# Altium schematic sheet sedsna.SchDoc
size 420 x 297 mm
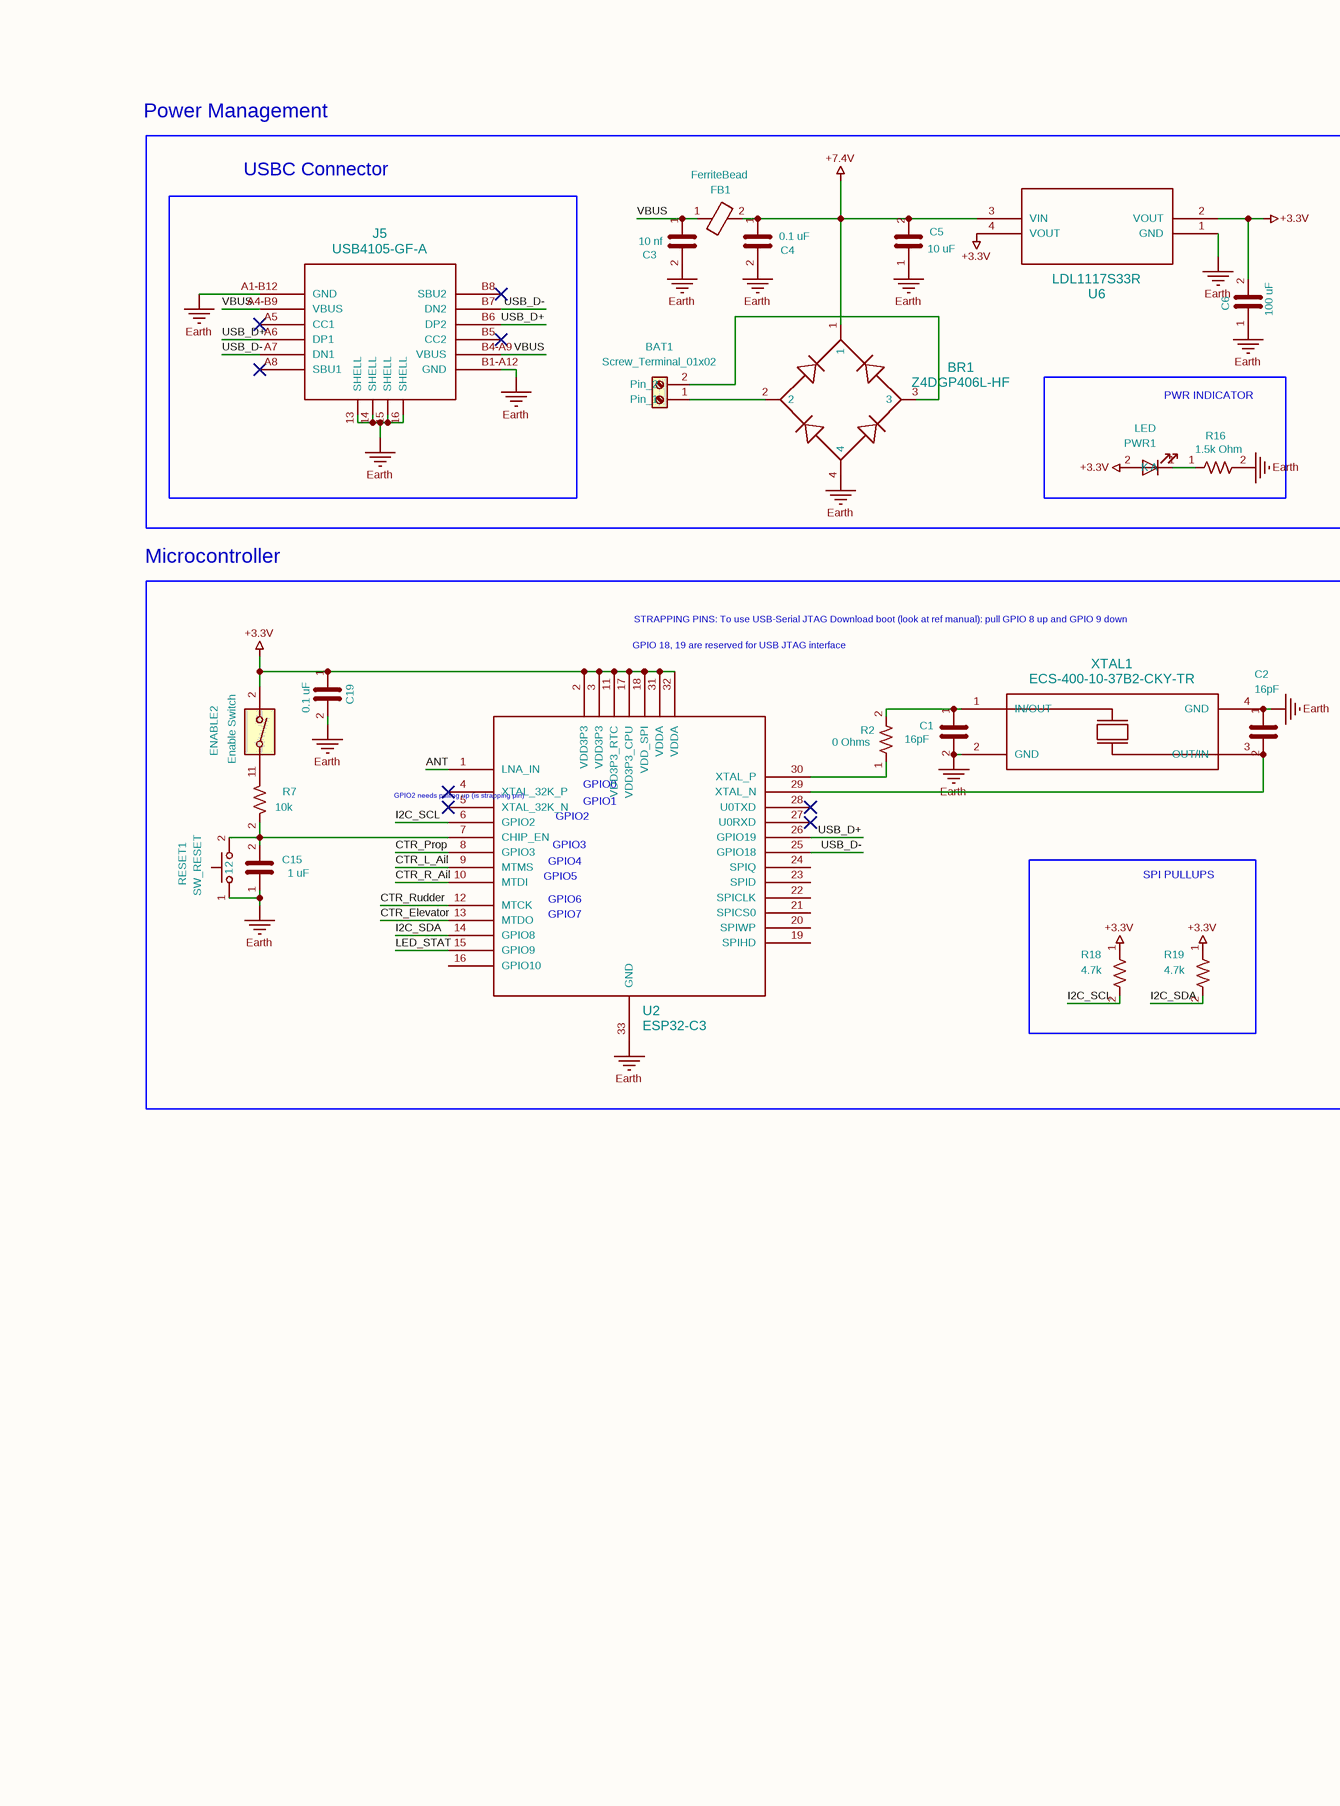
[diagram p0: sedsna.SchDoc, left]
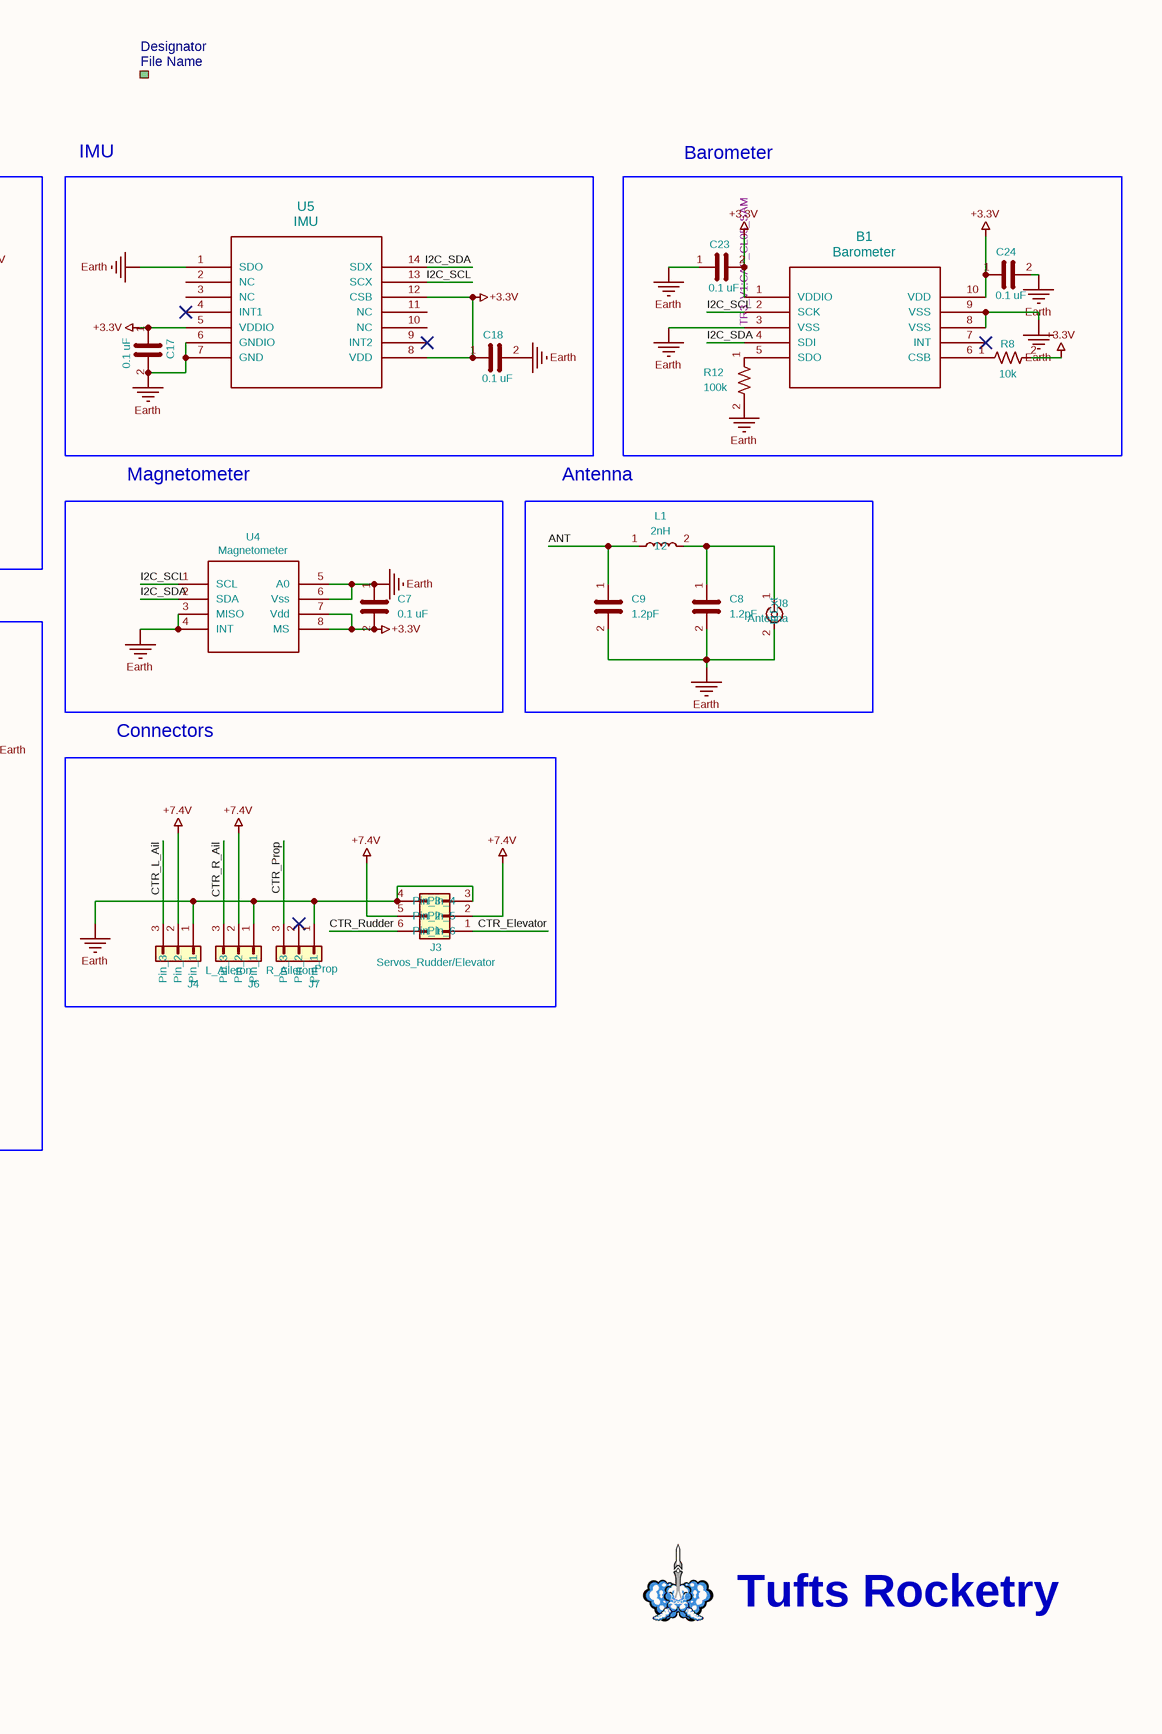
[diagram p1: sedsna.SchDoc, right]

## Parts
B1  Barometer  [QFN10_BMP581_BOS]
BAT1  Screw_Terminal_01x02  [TerminalBlock_bornier-2_P5.08mm]
BR1  Z4DGP406L-HF  [Z4DGP406L-HF_footprint_N]
C1  16pF
C2  16pF
C3  10 nf  [C_0603_1608Metric]
C4  0.1 uF  [CAP_CL05_SAM]
C5  10 uF  [C_0805_2012Metric]
C6  100 uF  [C_1206_3216Metric]
C7  0.1 uF
C8  1.2pF
C9  1.2pF
C15  1 uF  [C_0603_1608Metric]
C17  0.1 uF  [CAP_CL05_SAM]
C18  0.1 uF  [CAP_CL05_SAM]
C19  0.1 uF  [CAP_CL05_SAM]
C23  Footprint: TR3_V1:CAP_CL05_SAM  [CAP_CL05_SAM]  (hidden comment: 0.1 uF)
C24  0.1 uF  [CAP_CL05_SAM]
ENABLE2  Enable Switch  [SW_DS04-254-2-01BK-SMT]
FB1  FerriteBead  [FB_MI0805K400R-10]
J3  Servos_Rudder/Elevator
J4  L_Aileron
J5  USB4105-GF-A  [USB4105_GCT]
J6  R_Aileron
J7  Prop
J8  Antenna
L1  2nH
PWR1  LED  [150080RS75000_WRE]
R2  0 Ohms
R7  10k  [R_0603_1608Metric_Pad0.98x0.95mm_HandSolder]
R8  10k  [R_0603_1608Metric_Pad0.98x0.95mm_HandSolder]
R12  100k  [R_0603_1608Metric_Pad0.98x0.95mm_HandSolder]
R16  1.5k Ohm  [R_0603_1608Metric_Pad0.98x0.95mm_HandSolder]
R18  4.7k  [R_0603_1608Metric_Pad0.98x0.95mm_HandSolder]
R19  4.7k  [R_0603_1608Metric_Pad0.98x0.95mm_HandSolder]
RESET1  SW_RESET  [2-pronged_THT_button]
U2  ESP32-C3  [QFN32_5X5_EXP]
U4  Magnetometer
U5  IMU  [BMI323_BOS]
U6  LDL1117S33R  [SOT223_STM]
XTAL1  ECS-400-10-37B2-CKY-TR  [ECX-1637B2_ECS]

## Blocks framed on the sheet
Power Management: BAT1 BR1 C3-C6 FB1 U6
IMU: C17 C18 U5
Barometer /: B1 C23 C24 R8 R12
USBC Connector: J5
PWR INDICATOR: PWR1 R16
Magnetometer: C7 U4
Antenna: C8 C9 J8 L1
Microcontroller: C1 C2 C15 C19 ENABLE2 R2 R7 RESET1 U2 XTAL1
Connectors /: J3 J4 J6 J7
SPI PULLUPS: R18 R19

## Sub-sheets
Designator = File Name: no entries

## Nets
+3.3V: B1.1(VDDIO) B1.10(VDD) C6.2 C7.2 C17.1 C18.1 C19.1 C23.2 C24.1 ENABLE2.2 PWR1.2(A) R8.2 R18.1 R19.1 U2.2(VDD3P3) U2.3(VDD3P3) U2.11(VDD3P3_RTC) U2.17(VDD3P3_CPU) U2.18(VDD_SPI) U2.31(VDDA) U2.32(VDDA) U4.7(Vdd) U4.8(MS) U5.5(VDDIO) U5.8(VDD) U5.12(CSB) U6.2(VOUT) U6.4(VOUT)
+7.4V: BR1.1 C4.1 C5.2 FB1.2 J3.2(Pin_2) J3.5(Pin_5) J4.2(Pin_2) J6.2(Pin_2) U6.3(VIN)
Earth: B1.3(VSS) B1.8(VSS) B1.9(VSS) BR1.4 C1.2 C2.1 C3.2 C4.2 C5.1 C6.1 C7.1 C8.2 C9.2 C15.1 C17.2 C18.2 C19.2 C23.1 C24.2 J3.3(Pin_3) J3.4(Pin_4) J4.1(Pin_1) J5.13(SHELL) J5.14(SHELL) J5.15(SHELL) J5.16(SHELL) J5.A1-B12(GND) J5.B1-A12(GND) J6.1(Pin_1) J7.1(Pin_1) J8.2(Ext) R12.2 R16.2 RESET1.1 U2.33(GND) U4.3(MISO) U4.4(INT) U4.5(A0) U4.6(Vss) U5.1(SDO) U5.6(GNDIO) U5.7(GND) U6.1(GND) XTAL1.2(GND) XTAL1.4(GND)
ANT: C9.1 L1.1 U2.1(LNA_IN)
CTR_Elevator: J3.1(Pin_1) U2.13(MTDO)
CTR_L_Ail: J4.3(Pin_3) U2.9(MTMS)
CTR_Prop: J7.3(Pin_3) U2.8(GPIO3)
CTR_R_Ail: J6.3(Pin_3) U2.10(MTDI)
CTR_Rudder: J3.6(Pin_6) U2.12(MTCK)
I2C_SCL: B1.2(SCK) R18.2 U2.6(GPIO2) U4.1(SCL) U5.13(SCX)
I2C_SDA: B1.4(SDI) R19.2 U2.14(GPIO8) U4.2(SDA) U5.14(SDX)
LED_STAT: U2.15(GPIO9)
USB_D+: J5.A6(DP1) J5.B6(DP2) U2.26(GPIO19)
USB_D-: J5.A7(DN1) J5.B7(DN2) U2.25(GPIO18)
VBUS: C3.1 FB1.1 J5.A4-B9(VBUS) J5.B4-A9(VBUS)
NetB1_5: B1.5(SDO) R12.1
NetB1_6: B1.6(CSB) R8.1
NetBAT1_1: BAT1.1(Pin_1) BR1.2
NetBAT1_2: BAT1.2(Pin_2) BR1.3
NetC1_1: C1.1 R2.2 XTAL1.1(IN/OUT)
NetC2_2: C2.2 U2.29(XTAL_N) XTAL1.3(OUT/IN)
NetC8_1: C8.1 J8.1(In) L1.2
NetC15_2: C15.2 R7.2 RESET1.2 U2.7(CHIP_EN)
NetENABLE2_1: ENABLE2.1 R7.1
NetPWR1_1: PWR1.1(K) R16.1
NetR2_1: R2.1 U2.30(XTAL_P)

Not connected (* = marked no-connect by the designer): B1 7(INT)*; J5 A5(CC1)* A8(SBU1)* B5(CC2)* B8(SBU2)*; J7 2(Pin_2)*; U2 4(XTAL_32K_P)* 5(XTAL_32K_N)* 16(GPIO10) 19(SPIHD) 20(SPIWP) 21(SPICS0) 22(SPICLK) 23(SPID) 24(SPIQ) 27(U0RXD)* 28(U0TXD)*; U5 2(NC) 3(NC) 4(INT1)* 9(INT2)* 10(NC) 11(NC)

## Notes on the sheet
- GPIO 18, 19 are reserved for USB JTAG interface
- STRAPPING PINS: To use USB-Serial JTAG Download boot
  (look at ref manual): pull GPIO 8 up and GPIO 9 down
- (near U2) GPIO2 needs pulling up
  (is strapping pin)
- (near U2) GPIO1
- (near U2) GPIO0
- (near U2) GPIO5
- (near U2) GPIO4
- (near U2) GPIO3
- (near U2) GPIO2
- (near U2) GPIO6
- (near U2) GPIO7
- Tufts Rocketry
- 1
- 2
- 3
- 4
- 5
- 6
- 7
- 8
- A
- B
- C
- D
- E
- Title:
- File: sedsna.kicad_sch
- Sheet: /
- F
- KiCad E.D.A.  kicad (5.1.4)-1
- Size: A3
- Date:
- Rev:
- Id: 1/1

## Library data of the parts
B1 = BMP581: Value: Barometer
C1-C9 C15 C17-C19 C23 C24 = C
  C1 C2: Value: 16pF
  C3: Value: 10 nf
  C4 C7 C17-C19 C23 C24: Value: 0.1 uF
  C5: Value: 10 uF
  C6: Value: 100 uF
  C8 C9: Value: 1.2pF
  C15: Value: 1 uF
ENABLE2 = SW_DIP_x01: Value: Enable Switch
J3 = Conn_02x03_Counter_Clockwise: Value: Servos_Rudder/Elevator
J4 J6 J7 = Conn_01x03
  J4: Value: L_Aileron
  J6: Value: R_Aileron
  J7: Value: Prop
J8 = Conn_Coaxial_Small: Value: Antenna
L1 = L: Value: 2nH
R2 R7 R8 R12 R16 R18 R19 = R_US
  R2: Value: 0 Ohms
  R7 R8: Value: 10k
  R12: Value: 100k
  R16: Value: 1.5k Ohm
  R18 R19: Value: 4.7k
RESET1 = SW_Push: Value: SW_RESET
U4 = MAGNETO-MLX90395KDC: Value: Magnetometer
U5 = BMI323: Value: IMU
BAT1 = Screw_Terminal_01x02: Value: Screw_Terminal_01x02
BR1 = Z4DGP406L-HF: Value: Z4DGP406L-HF
FB1 = FerriteBead: Value: FerriteBead
J5 = USB4105-GF-A: Value: USB4105-GF-A
PWR1 = LED: Value: LED
U2 = ESP32-C3: Value: ESP32-C3
U6 = LDL1117S33R: Value: LDL1117S33R
XTAL1 = ECS-400-10-37B2-CKY-TR: Value: ECS-400-10-37B2-CKY-TR